# EAGLE schematic Teensy board v2 (EAGLE 9.2.2)
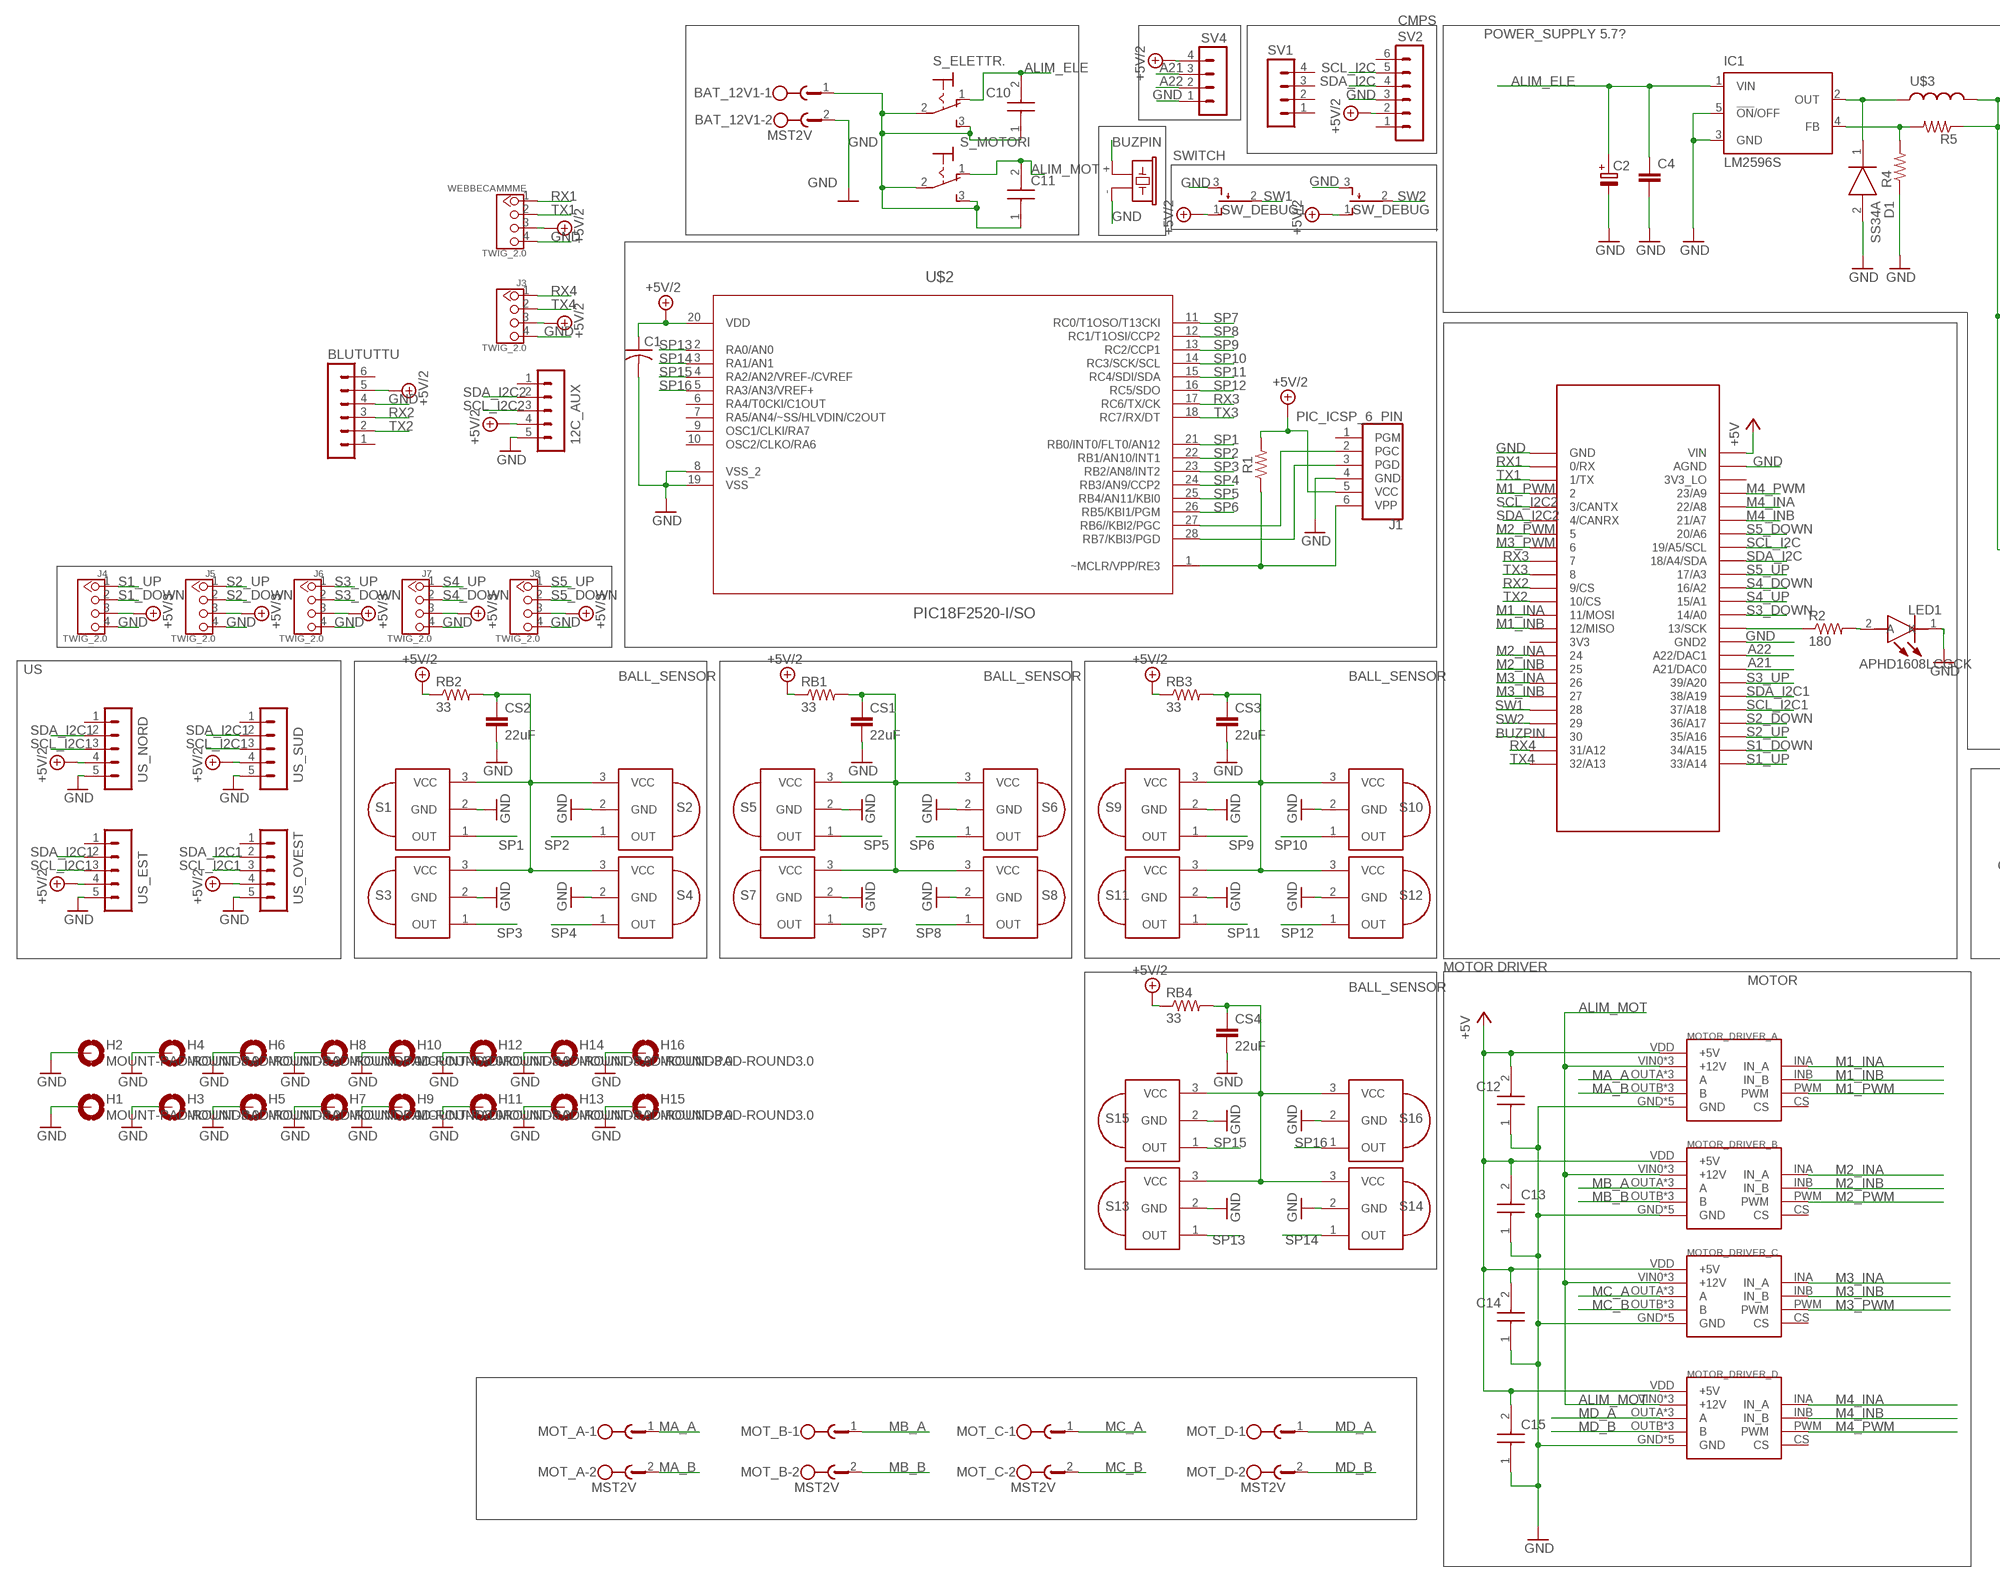
[diagram p0: schematic, sheet 1, part 1 of 2]
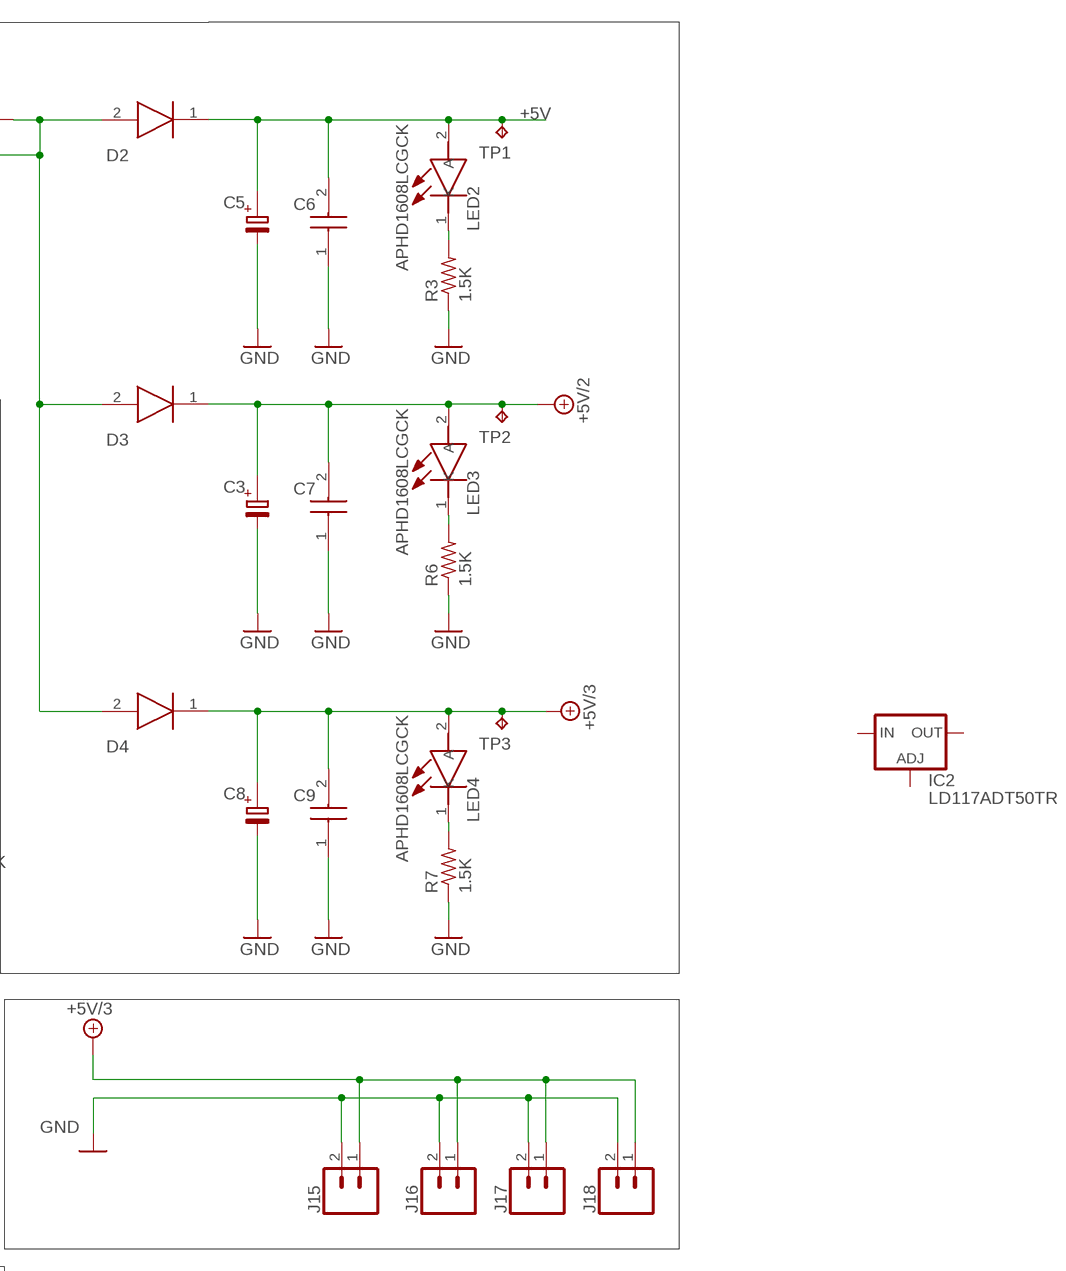
[diagram p1: schematic, sheet 1, part 2 of 2]

## Parts
12C_AUX  MA05-1  [MA05-1]
BAT_12V1  MST2V  [MSTBV2]
BLUTUTTU  MA06-1  [MA06-1]
C1  C-USC1206  [C1206]
C2  C-PR-SMD-SV-E/F  [SV-E/F]
C3  C-PR-SMD-SV-E/F  [SV-E/F]
C4  CC1206  [C1206]
C5  C-PR-SMD-SV-E/F  [SV-E/F]
C6  12065D106KAT2A  [CAPC3216X229N]
C7  12065D106KAT2A  [CAPC3216X229N]
C8  C-PR-SMD-SV-E/F  [SV-E/F]
C9  12065D106KAT2A  [CAPC3216X229N]
C10  12065D106KAT2A  [CAPC3216X229N]
C11  12065D106KAT2A  [CAPC3216X229N]
C12  12065D106KAT2A  [CAPC3216X229N]
C13  12065D106KAT2A  [CAPC3216X229N]
C14  12065D106KAT2A  [CAPC3216X229N]
C15  12065D106KAT2A  [CAPC3216X229N]
CS1  22uF  C-EUC1206  [C1206]
CS2  22uF  C-EUC1206  [C1206]
CS3  22uF  C-EUC1206  [C1206]
CS4  22uF  C-EUC1206  [C1206]
D1  SS34A  [DIOM5026X262N]
D2  SE20FG-M3_H  [SODFL3718X108N]
D3  SE20FG-M3_H  [SODFL3718X108N]
D4  SE20FG-M3_H  [SODFL3718X108N]
H1  MOUNT-PAD-ROUND3.0  [3,0-PAD]
H2  MOUNT-PAD-ROUND3.0  [3,0-PAD]
H3  MOUNT-PAD-ROUND3.0  [3,0-PAD]
H4  MOUNT-PAD-ROUND3.0  [3,0-PAD]
H5  MOUNT-PAD-ROUND3.0  [3,0-PAD]
H6  MOUNT-PAD-ROUND3.0  [3,0-PAD]
H7  MOUNT-PAD-ROUND3.0  [3,0-PAD]
H8  MOUNT-PAD-ROUND3.0  [3,0-PAD]
H9  MOUNT-PAD-ROUND3.0  [3,0-PAD]
H10  MOUNT-PAD-ROUND3.0  [3,0-PAD]
H11  MOUNT-PAD-ROUND3.0  [3,0-PAD]
H12  MOUNT-PAD-ROUND3.0  [3,0-PAD]
H13  MOUNT-PAD-ROUND3.0  [3,0-PAD]
H14  MOUNT-PAD-ROUND3.0  [3,0-PAD]
H15  MOUNT-PAD-ROUND3.0  [3,0-PAD]
H16  MOUNT-PAD-ROUND3.0  [3,0-PAD]
IC1  LM2596S  [TO263-5]
IC2  LD117ADT50TR  [DPACK]
J1  PIC_ICSP_6_PIN  [MOLEX-1X6]
J3  TWIG_2.0  [2.0_1X4]
J4  TWIG_2.0  [2.0_1X4]
J5  TWIG_2.0  [2.0_1X4]
J6  TWIG_2.0  [2.0_1X4]
J7  TWIG_2.0  [2.0_1X4]
J8  TWIG_2.0  [2.0_1X4]
J15  CONN_02  [1X02]
J16  CONN_02  [1X02]
J17  CONN_02  [1X02]
J18  CONN_02  [1X02]
LED1  APHD1608LCGCK  [LEDM168X80N]
LED2  APHD1608LCGCK  [LEDM168X80N]
LED3  APHD1608LCGCK  [LEDM168X80N]
LED4  APHD1608LCGCK  [LEDM168X80N]
MOT_A  MST2V  [MSTBV2]
MOT_B  MST2V  [MSTBV2]
MOT_C  MST2V  [MSTBV2]
MOT_D  MST2V  [MSTBV2]
MOTOR_DRIVER_A  VNH5019  [VNH5019]
MOTOR_DRIVER_B  VNH5019  [VNH5019]
MOTOR_DRIVER_C  VNH5019  [VNH5019]
MOTOR_DRIVER_D  VNH5019  [VNH5019]
R1  10k  R-US_M1206  [M1206]
R2  180  R-US_M1206  [M1206]
R3  1.5K  R-US_R1206  [R1206]
R4  R-US_R1206  [R1206]
R5  R-US_R1206  [R1206]
R6  1.5K  R-US_R1206  [R1206]
R7  1.5K  R-US_R1206  [R1206]
RB1  33  R-US_M1206  [M1206]
RB2  33  R-US_M1206  [M1206]
RB3  33  R-US_M1206  [M1206]
RB4  33  R-US_M1206  [M1206]
S1  PNA460XM  [PNA460XM]
S2  PNA460XM  [PNA460XM]
S3  PNA460XM  [PNA460XM]
S4  PNA460XM  [PNA460XM]
S5  PNA460XM  [PNA460XM]
S6  PNA460XM  [PNA460XM]
S7  PNA460XM  [PNA460XM]
S8  PNA460XM  [PNA460XM]
S9  PNA460XM  [PNA460XM]
S10  PNA460XM  [PNA460XM]
S11  PNA460XM  [PNA460XM]
S12  PNA460XM  [PNA460XM]
S13  PNA460XM  [PNA460XM]
S14  PNA460XM  [PNA460XM]
S15  PNA460XM  [PNA460XM]
S16  PNA460XM  [PNA460XM]
S_ELETTR.  320-916  [320-916]
S_MOTORI  320-916  [320-916]
SG1  F/CM12P  [F/CM12P]
SV1  MA04-1  [MA04-1]
SV2  MA06-1  [MA06-1]
SV4  MA04-1  [MA04-1]
SW_DEBUG  TL38PO  [TL3XPO]
SW_DEBUG1  TL38PO  [TL3XPO]
TP1  TPTP13SQ  [TP13SQ]
TP2  TPTP13SQ  [TP13SQ]
TP3  TPTP13SQ  [TP13SQ]
U$1  TEENSY_3.5/3.6  [TEENSY_3.5/3.6]
U$2  PIC18F2520-I/SO  [SOIC127P1030X265-28N]
U$3  MSS1260  [MSS1260]
US_EST  MA05-1  [MA05-1]
US_NORD  MA05-1  [MA05-1]
US_OVEST  MA05-1  [MA05-1]
US_SUD  MA05-1  [MA05-1]
WEBBECAMMME  TWIG_2.0  [2.0_1X4]

## Nets
5.7V-DIRAMAZIONE2: D2.2(A) D3.2(A) D4.2(A) R5.1 U$3.P$1
+5V: C5.+ C6.2 D2.1(K) LED2.2(A) TP1.TP U$1.VIN
+5V/2: 12C_AUX.4 BLUTUTTU.5 C1.1 C3.+ C7.2 D3.1(K) J1.5(VCC) J3.3 LED3.2(A) R1.2 RB1.1 RB2.1 RB3.1 RB4.1 SV2.2 SV4.4 SW_DEBUG1.1(O) SW_DEBUG.1(O) TP2.TP U$2.20(VDD) US_EST.4 US_NORD.4 US_OVEST.4 US_SUD.4 WEBBECAMMME.3
+5V/3: C8.+ C9.2 D4.1(K) J4.3 J5.3 J6.3 J7.3 J8.3 J15.1 J16.1 J17.1 J18.1 LED4.2(A) TP3.TP
A21: SV4.3 U$1.21/DAC0(A21/DAC0)
A22: SV4.2 U$1.A22/DAC1
ALIM_ELE [Power]: C2.+ C4.1 C10.2 IC1.1(VIN) S_ELETTR..1(O)
ALIM_MOT [Power]: C11.2 MOTOR_DRIVER_A.VIN0(+12V) MOTOR_DRIVER_A.VIN1(+12V) MOTOR_DRIVER_A.VIN2(+12V) MOTOR_DRIVER_B.VIN0(+12V) MOTOR_DRIVER_B.VIN1(+12V) MOTOR_DRIVER_B.VIN2(+12V) MOTOR_DRIVER_C.VIN0(+12V) MOTOR_DRIVER_C.VIN1(+12V) MOTOR_DRIVER_C.VIN2(+12V) MOTOR_DRIVER_D.VIN0(+12V) MOTOR_DRIVER_D.VIN1(+12V) MOTOR_DRIVER_D.VIN2(+12V) S_MOTORI.1(O)
BUZPIN: SG1.+ U$1.30
GND [Power]: 12C_AUX.5 BAT_12V1.2 BLUTUTTU.4 C1.2 C2.- C3.- C4.2 C5.- C6.1 C7.1 C8.- C9.1 C12.1 C13.1 C14.1 C15.1 CS1.2 CS2.2 CS3.2 CS4.2 D1.2(A) H1.B3,0(MOUNT) H2.B3,0(MOUNT) H3.B3,0(MOUNT) H4.B3,0(MOUNT) H5.B3,0(MOUNT) H6.B3,0(MOUNT) H7.B3,0(MOUNT) H8.B3,0(MOUNT) H9.B3,0(MOUNT) H10.B3,0(MOUNT) H11.B3,0(MOUNT) H12.B3,0(MOUNT) H13.B3,0(MOUNT) H14.B3,0(MOUNT) H15.B3,0(MOUNT) H16.B3,0(MOUNT) IC1.3(GND) IC1.5(!ON!/OFF) J1.4(GND) J3.4 J4.4 J5.4 J6.4 J7.4 J8.4 J15.2 J16.2 J17.2 J18.2 LED1.1(K) MOTOR_DRIVER_A.GND MOTOR_DRIVER_A.GND0(GND) MOTOR_DRIVER_A.GND1(GND) MOTOR_DRIVER_A.GND2(GND) MOTOR_DRIVER_A.GND3(GND) MOTOR_DRIVER_B.GND MOTOR_DRIVER_B.GND0(GND) MOTOR_DRIVER_B.GND1(GND) MOTOR_DRIVER_B.GND2(GND) MOTOR_DRIVER_B.GND3(GND) MOTOR_DRIVER_C.GND MOTOR_DRIVER_C.GND0(GND) MOTOR_DRIVER_C.GND1(GND) MOTOR_DRIVER_C.GND2(GND) MOTOR_DRIVER_C.GND3(GND) MOTOR_DRIVER_D.GND MOTOR_DRIVER_D.GND0(GND) MOTOR_DRIVER_D.GND1(GND) MOTOR_DRIVER_D.GND2(GND) MOTOR_DRIVER_D.GND3(GND) R3.1 R4.1 R6.1 R7.1 S1.2(GND) S2.2(GND) S3.2(GND) S4.2(GND) S5.2(GND) S6.2(GND) S7.2(GND) S8.2(GND) S9.2(GND) S10.2(GND) S11.2(GND) S12.2(GND) S13.2(GND) S14.2(GND) S15.2(GND) S16.2(GND) SG1.- SV2.3 SV4.1 SW_DEBUG1.3(S) SW_DEBUG.3(S) U$1.AGND U$1.GND U$1.GND2 U$2.8(VSS_2) U$2.19(VSS) US_EST.5 US_NORD.5 US_OVEST.5 US_SUD.5 WEBBECAMMME.4
M1_INA: MOTOR_DRIVER_A.INA(IN_A) U$1.11/MOSI
M1_INB: MOTOR_DRIVER_A.INB(IN_B) U$1.12/MISO
M1_PWM: MOTOR_DRIVER_A.PWM U$1.2
M2_INA: MOTOR_DRIVER_B.INA(IN_A) U$1.24
M2_INB: MOTOR_DRIVER_B.INB(IN_B) U$1.25
M2_PWM: MOTOR_DRIVER_B.PWM U$1.5
M3_INA: MOTOR_DRIVER_C.INA(IN_A) U$1.26
M3_INB: MOTOR_DRIVER_C.INB(IN_B) U$1.27
M3_PWM: MOTOR_DRIVER_C.PWM U$1.6
M4_INA: MOTOR_DRIVER_D.INA(IN_A) U$1.22/A8
M4_INB: MOTOR_DRIVER_D.INB(IN_B) U$1.21/A7
M4_PWM: MOTOR_DRIVER_D.PWM U$1.23/A9
MA_A: MOT_A.1 MOTOR_DRIVER_A.OUTA2(A) MOTOR_DRIVER_A.OUTA3(A) MOTOR_DRIVER_A.OUTA(A)
MA_B: MOT_A.2 MOTOR_DRIVER_A.OUTB1(B) MOTOR_DRIVER_A.OUTB3(B) MOTOR_DRIVER_A.OUTB(B)
MB_A [Power]: MOT_B.1 MOTOR_DRIVER_B.OUTA2(A) MOTOR_DRIVER_B.OUTA3(A) MOTOR_DRIVER_B.OUTA(A)
MB_B [Power]: MOT_B.2 MOTOR_DRIVER_B.OUTB1(B) MOTOR_DRIVER_B.OUTB3(B) MOTOR_DRIVER_B.OUTB(B)
MC_A [Power]: MOT_C.1 MOTOR_DRIVER_C.OUTA2(A) MOTOR_DRIVER_C.OUTA3(A) MOTOR_DRIVER_C.OUTA(A)
MC_B [Power]: MOT_C.2 MOTOR_DRIVER_C.OUTB1(B) MOTOR_DRIVER_C.OUTB3(B) MOTOR_DRIVER_C.OUTB(B)
MD_A: MOT_D.1 MOTOR_DRIVER_D.OUTA2(A) MOTOR_DRIVER_D.OUTA3(A) MOTOR_DRIVER_D.OUTA(A)
MD_B: MOT_D.2 MOTOR_DRIVER_D.OUTB1(B) MOTOR_DRIVER_D.OUTB3(B) MOTOR_DRIVER_D.OUTB(B)
N$1: J1.6(VPP) R1.1 U$2.1(~MCLR/VPP/RE3)
N$2: J1.3(PGD) U$2.28(RB7/KBI3/PGD)
N$3: J1.2(PGC) U$2.27(RB6//KBI2/PGC)
N$4: R2.1 U$1.13/SCK
N$5: LED1.2(A) R2.2
N$6: C12.2 C13.2 C14.2 C15.2 D1.1(K) IC1.2(OUT) MOTOR_DRIVER_A.VDD(+5V) MOTOR_DRIVER_B.VDD(+5V) MOTOR_DRIVER_C.VDD(+5V) MOTOR_DRIVER_D.VDD(+5V) U$3.P$2 ; supply symbol labelled +5V
N$7: IC1.4(FB) R4.2 R5.2
N$8: LED2.1(K) R3.2
N$10: LED3.1(K) R6.2
N$12: LED4.1(K) R7.2
N$14: BAT_12V1.1 C10.1 C11.1 S_ELETTR..2(P) S_ELETTR..3(S) S_MOTORI.2(P) S_MOTORI.3(S)
POWER_BLOK_1: CS1.1 RB1.2 S5.3(VCC) S6.3(VCC) S7.3(VCC) S8.3(VCC)
POWER_BLOK_2: CS2.1 RB2.2 S1.3(VCC) S2.3(VCC) S3.3(VCC) S4.3(VCC)
POWER_BLOK_3: CS3.1 RB3.2 S9.3(VCC) S10.3(VCC) S11.3(VCC) S12.3(VCC)
POWER_BLOK_4: CS4.1 RB4.2 S13.3(VCC) S14.3(VCC) S15.3(VCC) S16.3(VCC)
RX1: U$1.0/RX WEBBECAMMME.1
RX2: BLUTUTTU.3 U$1.9/CS
RX3: U$1.7 U$2.17(RC6/TX/CK)
RX4: J3.1 U$1.31/A12
S1_DOWN: J4.2 U$1.34/A15
S1_UP: J4.1 U$1.33/A14
S2_DOWN: J5.2 U$1.36/A17
S2_UP: J5.1 U$1.35/A16
S3_DOWN: J6.2 U$1.14/A0
S3_UP: J6.1 U$1.39/A20
S4_DOWN: J7.2 U$1.16/A2
S4_UP: J7.1 U$1.15/A1
S5_DOWN: J8.2 U$1.20/A6
S5_UP: J8.1 U$1.17/A3
SCL_I2C: SV2.5 U$1.19/A5/SCL
SCL_I2C1: U$1.37/A18 US_EST.3 US_NORD.3 US_OVEST.3 US_SUD.3
SCL_I2C2: 12C_AUX.3 U$1.3/CANTX
SDA_I2C: SV2.4 U$1.18/A4/SDA
SDA_I2C1: U$1.38/A19 US_EST.2 US_NORD.2 US_OVEST.2 US_SUD.2
SDA_I2C2: 12C_AUX.2 U$1.4/CANRX
SP1: S1.1(OUT) U$2.21(RB0/INT0/FLT0/AN12)
SP2: S2.1(OUT) U$2.22(RB1/AN10/INT1)
SP3: S3.1(OUT) U$2.23(RB2/AN8/INT2)
SP4: S4.1(OUT) U$2.24(RB3/AN9/CCP2)
SP5: S5.1(OUT) U$2.25(RB4/AN11/KBI0)
SP6: S6.1(OUT) U$2.26(RB5/KBI1/PGM)
SP7: S7.1(OUT) U$2.11(RC0/T1OSO/T13CKI)
SP8: S8.1(OUT) U$2.12(RC1/T1OSI/CCP2)
SP9: S9.1(OUT) U$2.13(RC2/CCP1)
SP10: S10.1(OUT) U$2.14(RC3/SCK/SCL)
SP11: S11.1(OUT) U$2.15(RC4/SDI/SDA)
SP12: S12.1(OUT) U$2.16(RC5/SDO)
SP13: S13.1(OUT) U$2.2(RA0/AN0)
SP14: S14.1(OUT) U$2.3(RA1/AN1)
SP15: S15.1(OUT) U$2.4(RA2/AN2/VREF-/CVREF)
SP16: S16.1(OUT) U$2.5(RA3/AN3/VREF+)
SW1: SW_DEBUG1.2(P) U$1.28
SW2: SW_DEBUG.2(P) U$1.29
TX1: U$1.1/TX WEBBECAMMME.2
TX2: BLUTUTTU.2 U$1.10/CS
TX3: U$1.8 U$2.18(RC7/RX/DT)
TX4: J3.2 U$1.32/A13
Unconnected: 12C_AUX.1 BLUTUTTU.1 BLUTUTTU.6 IC2.1(ADJ) IC2.3(IN) IC2.4(OUT) J1.1(PGM) MOTOR_DRIVER_A.CS MOTOR_DRIVER_B.CS MOTOR_DRIVER_C.CS MOTOR_DRIVER_D.CS SV1.1 SV1.2 SV1.3 SV1.4 SV2.1 SV2.6 U$1.3V3 U$1.3V3_LO U$2.6(RA4/T0CKI/C1OUT) U$2.7(RA5/AN4/~SS/HLVDIN/C2OUT) U$2.9(OSC1/CLKI/RA7) U$2.10(OSC2/CLKO/RA6) US_EST.1 US_NORD.1 US_OVEST.1 US_SUD.1

## Notes on the sheet
- CMPS
- POWER_SUPPLY 5.7?
- SWITCH
- US
- BALL_SENSOR | BALL_SENSOR | BALL_SENSOR
- MOTOR DRIVER
- MOTOR
- BALL_SENSOR

## Library data of the parts
12C_AUX US_EST US_NORD US_OVEST US_SUD = con-lstb:MA05-1: PIN HEADER; OC_FARNELL: unknown; OC_NEWARK: unknown
BAT_12V1 MOT_A MOT_B MOT_C MOT_D = con-phoenix-508:MST2V: PHOENIX; OC_FARNELL: unknown; OC_NEWARK: unknown
BLUTUTTU SV2 = con-lstb:MA06-1: PIN HEADER; OC_FARNELL: unknown; OC_NEWARK: unknown
C1 = adafruit:C-US: CAPACITOR, American symbol
C2 C3 C5 C8 = cap-pan40:C-PR: POLARIZED ELECTROLYTIC/TANTALUM
C4 = eagle-ltspice:C: CAPACITOR, European symbol; SPICEMODEL: NONE; SPICEPREFIX: C
C6 C7 C9-C15 = 12065D106KAT2A:12065D106KAT2A: Multilayer Ceramic Capacitors MLCC - SMD/SMT 50V 10uF X5R 1206 10% HIGH CV Source: Datasheet <http://datasheets.avx.com/cx5r.pdf>; DESCRIPTION: Multilayer Ceramic Capacitors MLCC - SMD/SMT 50V 10uF X5R 1206 10% HIGH CV; HEIGHT: 2.29mm; MANUFACTURER_NAME: AVX; MANUFACTURER_PART_NUMBER: 12065D106KAT2A
CS1-CS4 = rcl:C-EU: CAPACITOR, European symbol
D1 = SamacSys_Parts:SS34A: HY Electronic Corp SS34A, SMT Rectifier Schottky Diode, 40V 3A, 2-Pin SMA Source: Datasheet <http://uk.rs-online.com/web/p/products/1711454>; DESCRIPTION: HY Electronic Corp SS34A, SMT Rectifier Schottky Diode, 40V 3A, 2-Pin SMA; HEIGHT: 2.62mm; MANUFACTURER_NAME: HY Electronic Corp; MANUFACTURER_PART_NUMBER: SS34A; RS_PART_NUMBER: 1711454
D2-D4 = SE20FG-M3_H:SE20FG-M3_H: Diode Rectifier 2A 400V Standard DO219AB Vishay SE20FG-M3/H, SMT Diode, 400V 2A, 920ns, 2-Pin DO-219AB Source: Datasheet <http://uk.rs-online.com/web/p/products/8949262P>; DESCRIPTION: Diode Rectifier 2A 400V Standard DO219AB Vishay SE20FG-M3/H, SMT Diode, 400V 2A, 920ns, 2-Pin DO-219AB; HEIGHT: 1.08mm; MANUFACTURER_NAME: Vishay; MANUFACTURER_PART_NUMBER: SE20FG-M3/H; RS_PART_NUMBER: 8949262P
H1-H16 = holes:MOUNT-PAD-ROUND: MOUNTING PAD, round
IC1 = national-semiconductor:LM2596: SIMPLE SWITCHER® Power Converter 150 kHz 3A Step-Down Voltage Regulator Source: http://www.national.com/ds/LM/LM2596.pdf; MF: NATIONAL SEMICONDUCTOR; MPN: LM2596S-ADJ/NOPB; OC_FARNELL: 9494367; OC_NEWARK: 41K3842
IC2 = v-reg:LD117A?*: Low drop fixed and adjustable positive voltage regulators 1 A Source: http://www.st.com/stonline/products/literature/ds/7194/ld1117axx.pdf
J1 = SparkFun-Connectors:PIC_ICSP_6_PIN: ISCP Programming connector for PICs This 6 pin header contains all the lines necessary for programming most PIC microcontrollers. Here is the connector we sell at SparkFun: Polarized Connectors - Header (6-Pin) <https://www.sparkfun.com/products/8094> (PRT-08094) It is used on this SparkFun product: SparkFun UDB5 - PIC UAV Development Board <https://www.sparkfun.com/products/11703> (DEV-11703) Also, if you need a nice PIC programmer, please check these out: MPLAB PICkit 3 <https://www.sparkfun.com/products/9973> (PGM-09973); PROD_ID: CONN-08046; SF_ID: PRT-08094
J3-J8 WEBBECAMMME = CONNECTER:TWIG_2.0
J15-J18 = SparkFun-Connectors:CONN_02: Multi connection point. Often used as Generic Header-pin footprint for 0.1 inch spaced/style header connections On any of the 0.1 inch spaced packages, you can populate with these: Break Away Headers - Straight <https://www.sparkfun.com/products/116> (PRT-00116) Break Away Male Headers - Right Angle <https://www.sparkfun.com/products/553> (PRT-00553) Female Headers <https://www.sparkfun.com/products/115> (PRT-00115) Break Away Headers - Machine Pin <https://www.sparkfun.com/products/117> (PRT-00117) Break Away Female Headers - Swiss Machine Pin <https://www.sparkfun.com/products/743> (PRT-00743) For SCREWTERMINALS and SPRING TERMINALS visit here: Screw Terimnals on SparkFun.com <https://www.sparkfun.com/search/results?term=Screw+Terminals> (5mm/3.5mm/2.54mm spacing) This device is also useful as a general connection point to wire up your design to another part of your project. Our various solder wires solder well into these plated through hole pads. Hook-Up Wire - Assortment (Stranded, 22 AWG) <https://www.sparkfun.com/products/11375> (PRT-11375) Hook-Up Wire - Assortment (Solid Core, 22 AWG) <https://www.sparkfun.com/products/11367> (PRT-11367) View the entire wire category on our website here <https://www.sparkfun.com/categories/141> Special notes: Molex polarized connector foot print use with: PRT-08233 with associated crimp pins and housings. 2.54_SCREWTERM for use with PRT-10571. 3.5mm Screw Terminal footprints for PRT-08084 5mm Screw Terminal footprints for use with PRT-08432
LED1-LED4 = SamacSys_Parts:APHD1608LCGCK: Standard LEDs - SMD 0603 Dome Lens LED Green- 570nm Source: Datasheet <http://www.mouser.com/datasheet/2/216/APHD1608LCGCK-1100472.pdf>; DESCRIPTION: Standard LEDs - SMD 0603 Dome Lens LED Green- 570nm; HEIGHT: 0.8mm; MANUFACTURER_NAME: Kingbright; MANUFACTURER_PART_NUMBER: APHD1608LCGCK; MOUSER_PART_NUMBER: 604-APHD1608LCGCK
MOTOR_DRIVER_A MOTOR_DRIVER_B MOTOR_DRIVER_C MOTOR_DRIVER_D = DRIVER POLOLU:VNH5019: aggiornato il 24/10/14 con pin cs (AD)
R1-R7 RB1-RB4 = adafruit:R-US_: RESISTOR, American symbol
S1-S16 = adafruit:PNA460XM: IR 38KHz receiver PNA4602 and related receivers http://www.ladyada.net/library/pcb/eaglelibrary.html
S_ELETTR. S_MOTORI = switch:320-916: TOGGLE SWITCH distributor RS Components
SG1 = buzzer:F/CM12P: BUZZER Source: Buerklin; OC_FARNELL: unknown; OC_NEWARK: unknown
SV1 SV4 = con-lstb:MA04-1: PIN HEADER; OC_FARNELL: unknown; OC_NEWARK: unknown
SW_DEBUG SW_DEBUG1 = switch:TL38PO: TINY SWITCH ON OFF MOM Source: http://www2.produktinfo.conrad.com/datenblaetter/700000-724999/705152-da-01-de-Subminiaturschalter_TL_36YO.pdf
TP1-TP3 = testpad:TP: Test pad
U$1 = Teensy356:TEENSY_3.5/3.6
U$2 = Microchip_By_element14_Batch_1:PIC18F2520-I/SO: Enhanced Flash Microcontroller; DESCRIPTION: Enhanced Flash Microcontroller; MPN: PIC18F2520-I/SO; OC_FARNELL: 9321241; OC_NEWARK: 89H0593; PACKAGE: SOIC-28; SUPPLIER: Microchip
U$3 = inductor-coilcraft:MSS1260: SMT Power Inductor

## Net classes
0 default: width 0.254 mm
1 Power: width 0.508 mm, clearance 0.508 mm
2 Power mot: width 1.93 mm